# EAGLE design can4vscp_usb_rev_c (EAGLE 6.6.0)
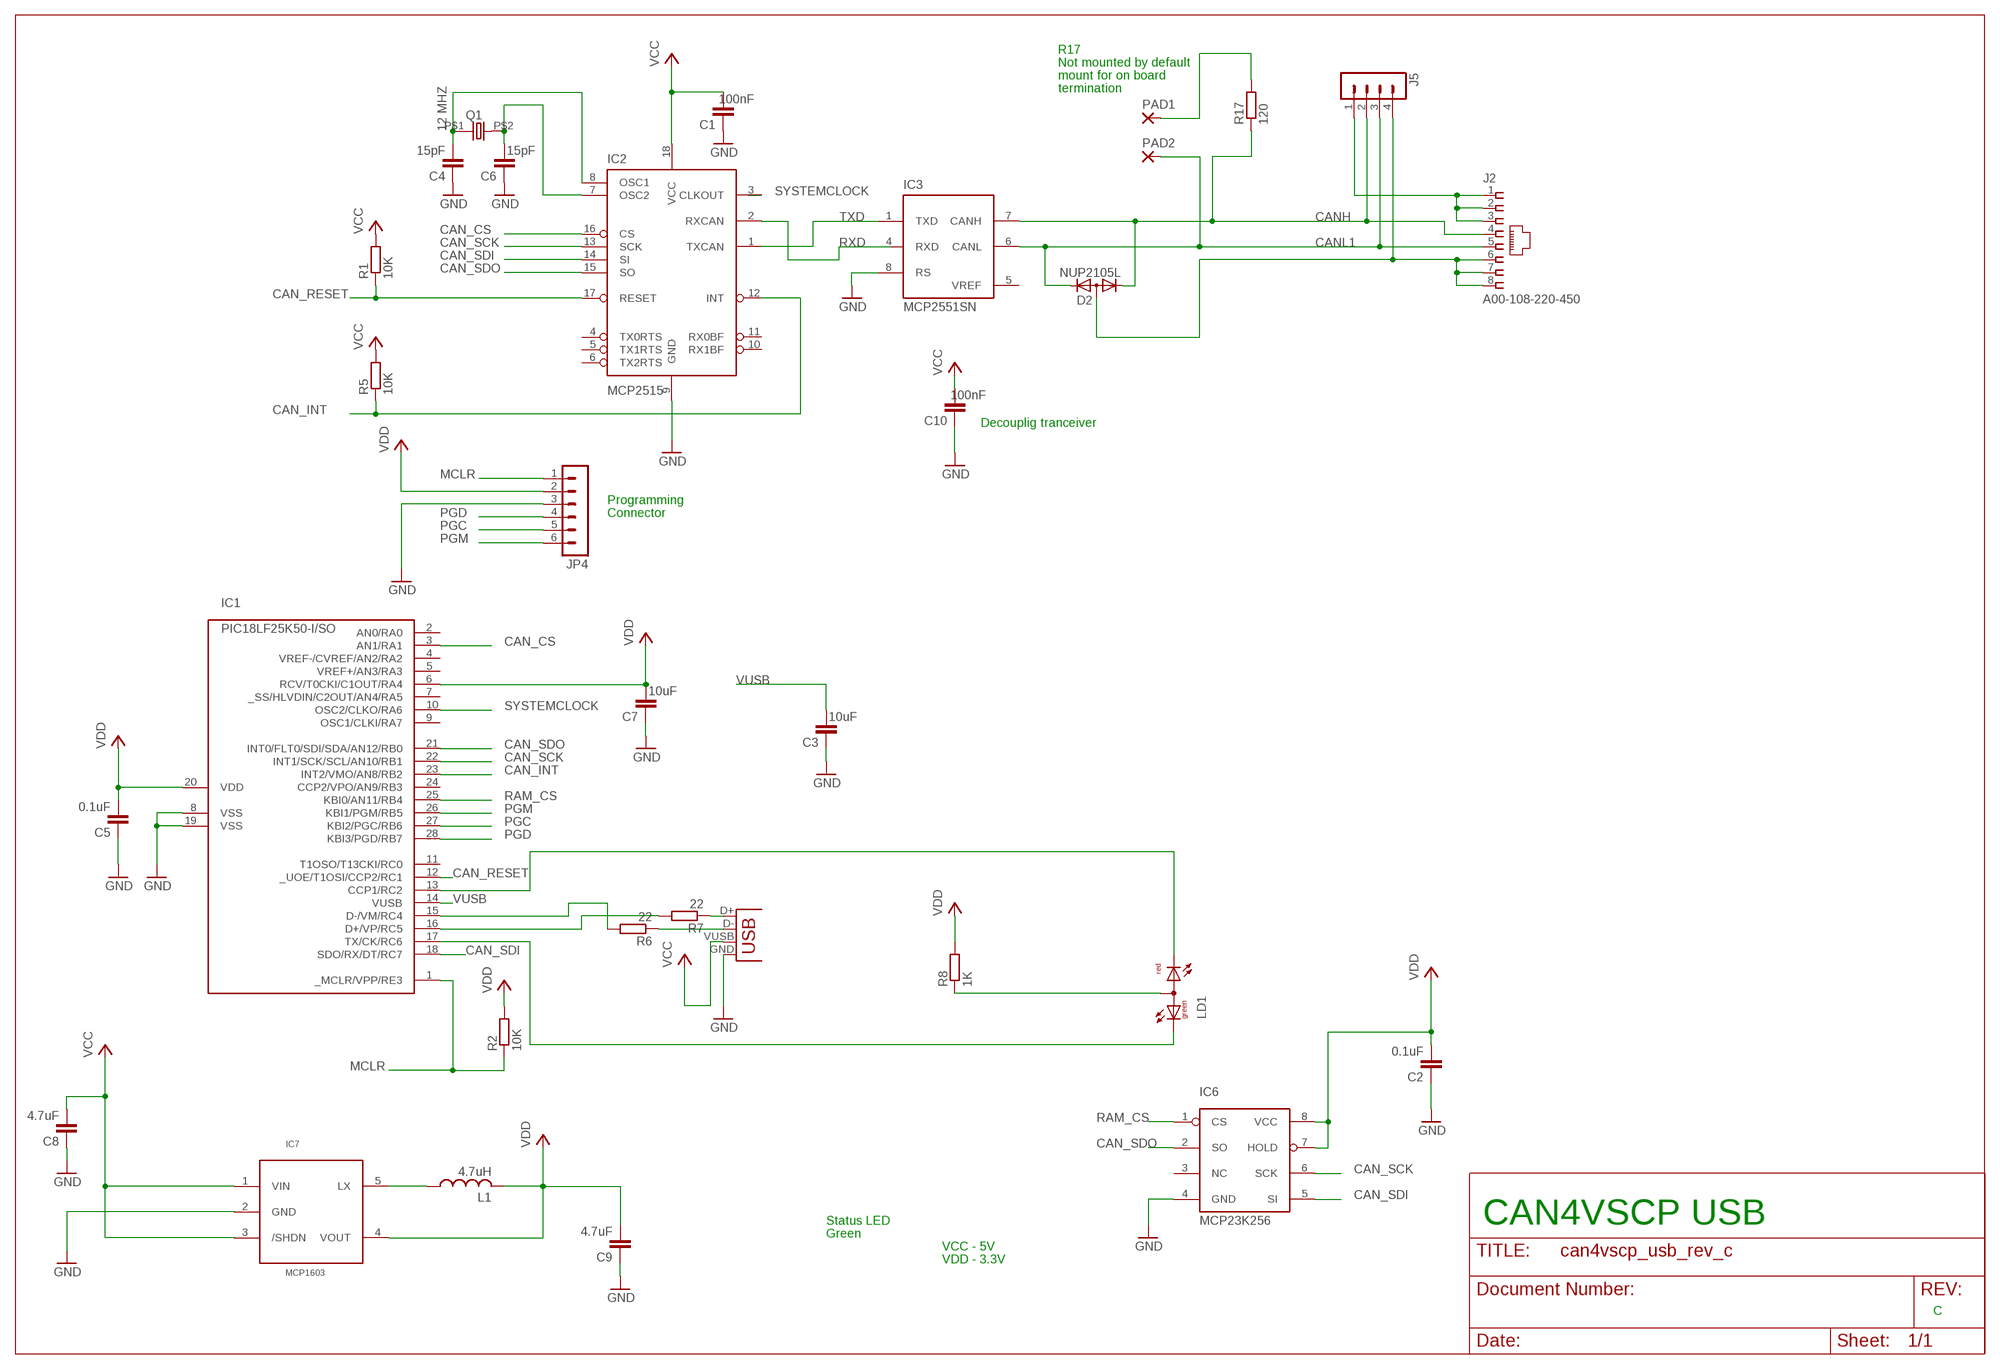
[diagram p0: schematic, sheet 1]

## Parts
C1  100nF  C-EUC0805  [C0805]
C2  0.1uF  C-EUC0805  [C0805]
C3  10uF  C-EUC0805  [C0805]
C4  15pF  C-EUC0805  [C0805]
C5  0.1uF  C-EUC0805  [C0805]
C6  15pF  C-EUC0805  [C0805]
C7  10uF  C-EUC0805  [C0805]
C8  4.7uF  C-EUC0805  [C0805]
C9  4.7uF  C-EUC0805  [C0805]
C10  100nF  C-EUC0805  [C0805]
D2  NUP2105L  DIODE-2CA|ACSOT23  [SOT23]
IC1  PIC18LF25K50-I/SO  PIC18LF2550-I/SO  [SO-28W]
IC2  MCP2515  [SO-18W]
IC3  MCP2551SN  [SO-08]
IC6  MCP23K256  MCP23A256  [SO-8]
IC7  MCP1603  [SOT23-5L]
J2  A00-108-220-450  [RJ-45]
J4  USB-B-S  [USB-B-SMT]
J5  MA04-1  [MA04-1]
JP4  MA06-1  [MA06-1]
L1  4.7uH  L-USL2012C  [L2012C]
LD1  DUOLED-RG-A  [DUOLED-A-5MM]
PAD1  1,6/0,8  [1,6/0,8]
PAD2  1,6/0,8  [1,6/0,8]
Q1  12 MHZ  HC-49S  [9C]
R1  10K  R-EU_R0805  [R0805]
R2  10K  R-EU_R0805  [R0805]
R5  10K  R-EU_R0805  [R0805]
R6  22  R-EU_R0805  [R0805]
R7  22  R-EU_R0805  [R0805]
R8  1K  R-EU_R0805  [R0805]
R17  120  R-EU_R0805  [R0805]

## Nets
CAN_CS: IC1.3(AN1/RA1) IC2.16(CS)
CAN_INT: IC1.23(INT2/VMO/AN8/RB2) IC2.12(INT) R5.1
CAN_RESET: IC1.12(_UOE/T1OSI/CCP2/RC1) IC2.17(RESET) R1.1
CAN_SCK: IC1.22(INT1/SCK/SCL/AN10/RB1) IC2.13(SCK) IC6.6(SCK)
CAN_SDI: IC1.18(SDO/RX/DT/RC7) IC2.14(SI) IC6.5(SI)
CAN_SDO: IC1.21(INT0/FLT0/SDI/SDA/AN12/RB0) IC2.15(SO) IC6.2(SO)
CANH: D2.1(K1) IC3.7(CANH) J2.4 J5.2 R17.1
CANL1: D2.2(K2) IC3.6(CANL) J2.5 J5.3 PAD2.1(P)
GND: C1.1 C2.1 C3.1 C4.1 C5.1 C6.1 C7.1 C8.1 C9.1 C10.1 D2.3(A) IC1.8(VSS) IC1.19(VSS) IC2.9(GND) IC3.8(RS) IC6.4(GND) IC7.2(GND) J2.6 J2.7 J2.8 J4.GND J5.4 JP4.3
MCLR: IC1.1(_MCLR/VPP/RE3) JP4.1 R2.1
N$1: IC1.16(D+/VP/RC5) R7.2
N$2: C4.2 IC2.8(OSC1) Q1.P$1
N$3: IC1.15(D-/VM/RC4) R6.2
N$6: IC1.13(CCP1/RC2) LD1.CR
N$7: C6.2 IC2.7(OSC2) Q1.P$2
N$8: LD1.A R8.1
N$9: IC1.17(TX/CK/RC6) LD1.CX(CG)
N$11: PAD1.1(P) R17.2
N$12: J2.1 J2.2 J2.3 J5.1
N$13: J4.D- R6.1
N$14: J4.D+ R7.1
N$16: IC7.5(LX) L1.1
PGC: IC1.27(KBI2/PGC/RB6) JP4.5
PGD: IC1.28(KBI3/PGD/RB7) JP4.4
PGM: IC1.26(KBI1/PGM/RB5) JP4.6
RAM_CS: IC1.25(KBI0/AN11/RB4) IC6.1(CS)
RXD: IC2.2(RXCAN)
SYSTEMCLOCK: IC1.10(OSC2/CLKO/RA6) IC2.3(CLKOUT)
TXD: IC2.1(TXCAN) IC3.1(TXD)
VCC: C1.2 C8.2 C10.2 IC2.18(VCC) IC7.1(VIN) IC7.3(/SHDN) J4.VUSB(VBUS) R1.2 R5.2
VDD: C2.2 C5.2 C7.2 C9.2 IC1.6(RCV/T0CKI/C1OUT/RA4) IC1.20(VDD) IC6.7(HOLD) IC6.8(VCC) IC7.4(VOUT) JP4.2 L1.2 R2.2 R8.2
VUSB: C3.2 IC1.14(VUSB)
Unconnected: IC1.2(AN0/RA0) IC1.4(VREF-/CVREF/AN2/RA2) IC1.5(VREF+/AN3/RA3) IC1.7(_SS/HLVDIN/C2OUT/AN4/RA5) IC1.9(OSC1/CLKI/RA7) IC1.11(T1OSO/T13CKI/RC0) IC1.24(CCP2/VPO/AN9/RB3) IC2.4(TX0RTS) IC2.5(TX1RTS) IC2.6(TX2RTS) IC2.10(RX1BF) IC2.11(RX0BF) IC3.4(RXD) IC6.3(NC)

## Notes on the sheet
- R17
- Not mounted by default
- mount for on board
- termination
- Decouplig tranceiver
- Programming
- Connector
- Status LED | CAN4VSCP USB
- Green
- VCC - 5V
- VDD - 3.3V
- C

## Power pins joined to a net without a drawn wire
GND: IC3.2(VSS)
VCC: IC3.3(VDD)
VREF: IC3.5(VREF)

## Library data of the parts
C1-C10 = rcl:C-EU: CAPACITOR, European symbol
D2 = diode:DIODE-2CA|AC: Dual DIODE Cathode-Anode|Anode-Cathode
IC1 = microchip-pic18fxx5x:PIC18*2550: PIC18*2550 Microchip FLASH Microcontroller with FS-USB DEVICE FEATURES Feature PIC18*2550 Program Memory (bytes) 32k Program Memory (instructions) 16384 I/O Ports Ports A, B, C, (E) Capture/Compare/PWM Modules 2 Enhanced Capture/Compare/PWM Modules 0 Parallel Communications (PSP) No 10-bit Analog-to-Digital Module 10 input Channels Package Types 28-pin PDIP 28-pin SOIC NOTES: F only after 18, means standard voltage range from 4.2v to 5.5v LF after 18, means extended voltage range from 2.0v to 5.5v T after entire device number, means supplied in tape and reel TQFP packages only -E before / denotes extended temperature range from -40°C to +120°C -I before / denotes industrial temperature range from -40°C to +85°C /PT suffix denotes TQFP package /SO suffix denotes SOIC package /SP suffix denotes Skinny Plastic DIP package /P suffix denotes Plastic DIP package /ML suffix denotes QFN package
IC2 = vscpcan:MCP2515
IC3 = microchip_can:MCP2551: High Speed CAN tranceiver
IC6 = vscpcan:MCP23A256
IC7 = eurosource_mcp1603:MCP1603
J2 = vscpcan:A00-108-220-450
J4 = con-usb:USB: USB Connectors
J5 = con-lstb:MA04-1: PIN HEADER; OC_FARNELL: unknown; OC_NEWARK: unknown
JP4 = con-lstb:MA06-1: PIN HEADER; OC_FARNELL: unknown; OC_NEWARK: unknown
L1 = rcl:L-US: INDUCTOR, American symbol
LD1 = led:DUOLED-RG-A: DUO LED 2 colors (red/green), 5 mm, round, common Anode www.ligitek.com or other producers.
PAD1 PAD2 = wirepad:1,6/0,8: THROUGH-HOLE PAD
Q1 = vscpcan:HC-49S: Digikey 887-1050-1-nd
R1 R2 R5-R8 R17 = rcl:R-EU_: RESISTOR, European symbol

## Board
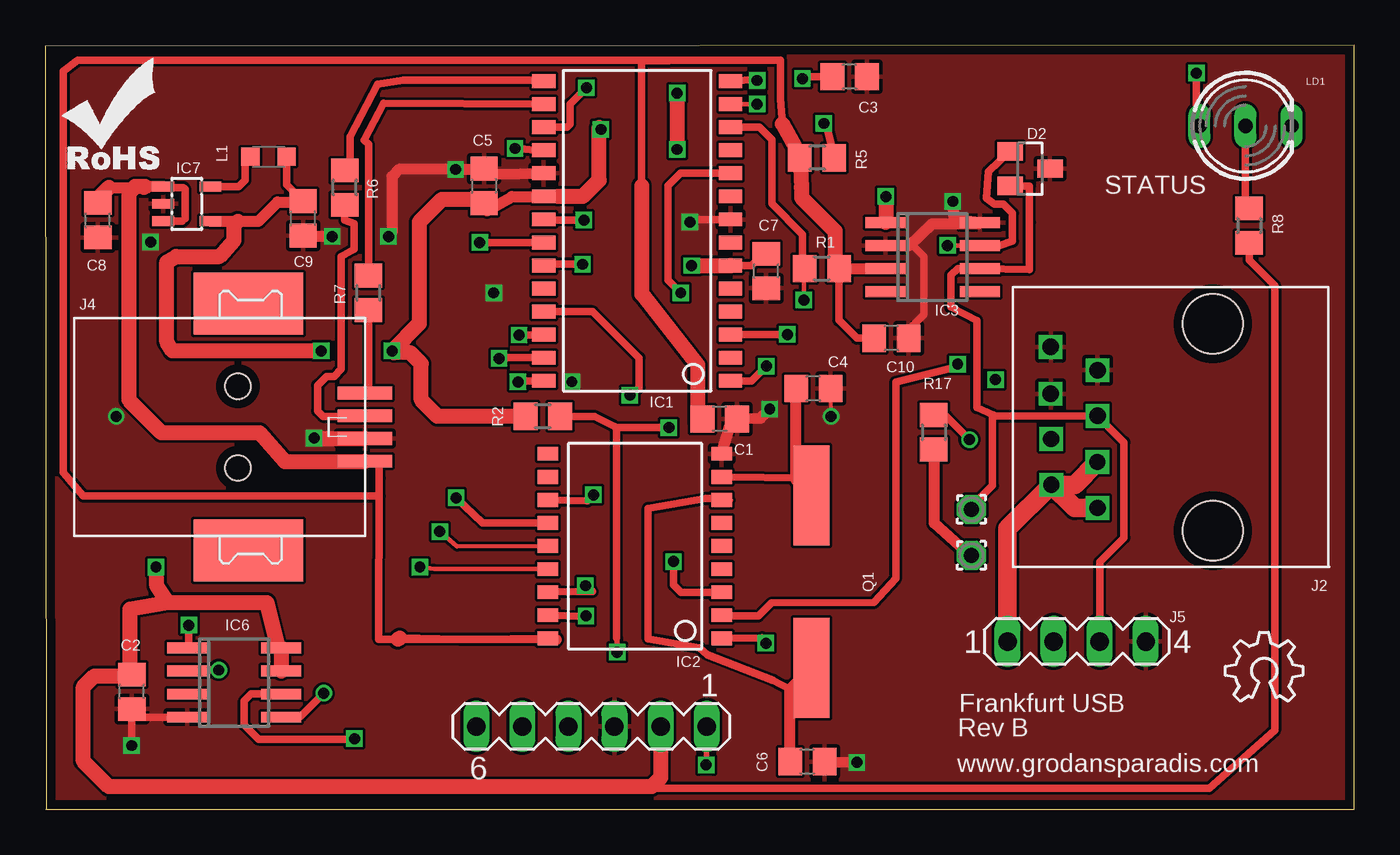
[diagram p1: board, top side]
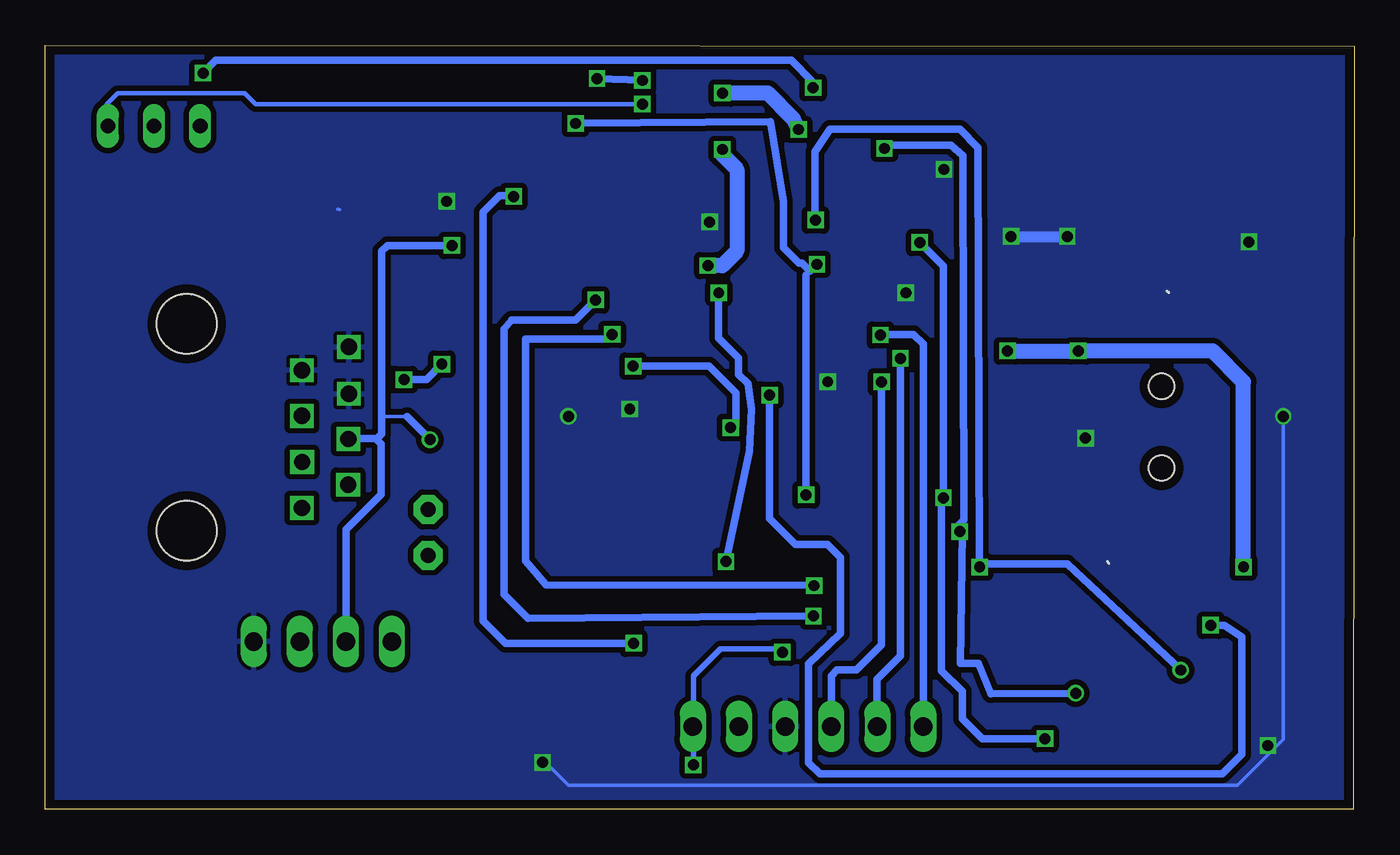
[diagram p2: board, bottom side, seen from below]

Size 72.07 x 42.08 mm. Coordinates in mm from the lower left corner, seen from the top.
Outline: 0.01,0 72.07,0 72.07,42.08 0,42.03 0.05,0.01
Copper layers (1*16): Top 0.035mm / dielectric 1.5mm / Bottom 0.035mm
Design rules "PCB-POOL": minimum track width 6mil, minimum drill 12mil, track to track 6mil, track to pad 6mil, pad to pad 6mil, via to via 6mil, smd to smd 6mil, copper to edge 20mil, drill to drill 8mil, minimum pad ring 8mil, minimum via ring 6mil, stop-mask expansion 3mil, vias tented up to drill 0mil, thermal gap 8mil

### Footprints (pad centres in the part's own frame; a part is rotated, then mirrored left to right if it is on the bottom)
C0805 = smd 1.3 x 1.5: 1 -0.95,0; 2 0.95,0
SOT23 = smd 1 x 1.4: 1 -0.95,-1.1; 2 0.95,-1.1; 3 0,1.1
SO-28W = smd 0.762 x 1.27: 1 -7.62,-5.207; 2 -6.35,-5.207; 3 -5.08,-5.207; 4 -3.81,-5.207; 5 -2.54,-5.207; 6 -1.27,-5.207; 7 0,-5.207; 8 1.27,-5.207; 9 2.54,-5.207; 10 3.81,-5.207; 11 5.08,-5.207; 12 6.35,-5.207; 13 7.62,-5.207; 14 8.89,-5.207; 15 8.89,5.08; 16 7.62,5.08; 17 6.35,5.08; 18 5.08,5.08; 19 3.81,5.08; 20 2.54,5.08; 21 1.27,5.08; 22 0,5.08; 23 -1.27,5.08; 24 -2.54,5.08; 25 -3.81,5.08; 26 -5.08,5.08; 27 -6.35,5.08; 28 -7.62,5.08
SO-18W = smd 0.762 x 1.143: 1 -5.08,-4.788; 2 -3.81,-4.788; 3 -2.54,-4.788; 4 -1.27,-4.788; 5 0,-4.788; 6 1.27,-4.788; 7 2.54,-4.788; 8 3.81,-4.788; 9 5.08,-4.788; 10 5.08,4.788; 11 3.81,4.788; 12 2.54,4.788; 13 1.27,4.788; 14 0,4.788; 15 -1.27,4.788; 16 -2.54,4.788; 17 -3.81,4.788; 18 -5.08,4.788
SO-08 = smd 0.6 x 2.2: 1 -1.905,-2.6; 2 -0.635,-2.6; 3 0.635,-2.6; 4 1.905,-2.6; 5 1.905,2.6; 6 0.635,2.6; 7 -0.635,2.6; 8 -1.905,2.6
SO-8 = smd 0.6 x 2.2: 1 -1.905,-2.6; 2 -0.635,-2.6; 3 0.635,-2.6; 4 1.905,-2.6; 5 1.905,2.6; 6 0.635,2.6; 7 -0.635,2.6; 8 -1.905,2.6
SOT23-5L = smd 0.55 x 1.2: 1 -0.95,-1.3; 2 0,-1.3; 3 0.95,-1.3; 4 0.95,1.3; 5 -0.95,1.3
RJ-45 = drill 0.9 square: 1 -4.45,6.35; 2 -3.17,8.89; 3 -1.92,6.36; 4 -0.65,8.91; 5 0.62,6.35; 6 1.84,8.93; 7 3.14,6.35; 8 4.42,8.93 | hole 3.3: -5.7,0; 5.7,0
USB-B-SMT = smd 6.04 x 3.4: 5 0.58,6.8; 6 0.58,-6.8 | smd 3 x 0.7: D+ 7,1.875; D- 7,0.625; GND 7,-0.625; VUSB 7,-1.875 | hole 1.4: 0,2.25; 0,-2.25
MA04-1 = drill 1.016 long: 1 -3.81,0; 2 -1.27,0; 3 1.27,0; 4 3.81,0
MA06-1 = drill 1.016 long: 1 -6.35,0; 2 -3.81,0; 3 -1.27,0; 4 1.27,0; 5 3.81,0; 6 6.35,0
L2012C = smd 1 x 1: 1 -1,0; 2 1,0
DUOLED-A-5MM = drill 0.813 long: A 0,0; CR 2.54,0; CX -2.54,0
1,6/0,8 = drill 0.813 pad 1.6 octagon: 1 0,0
9C = smd 5.5 x 2: P$1 -4.74,0; P$2 4.76,0
R0805 = smd 1.3 x 1.5: 1 -0.95,0; 2 0.95,0

### Placement (x,y rotation side)
C1  37.14,21.5 180 top
C2  4.76,6.48 90 top
C3  44.29,40.35 180 top
C4  42.29,23.17 180 top
C5  24.15,34.34 270 top
C6  41.96,2.63 180 top
C7  39.69,29.65 90 top
C8  2.89,32.45 90 top
C9  14.19,32.55 90 top
C10  46.59,25.95 180 top
D2  54.22,35.29 270 top
IC1  32.53,31.22 90 top
IC2  32.46,14.5 90 top
IC3  48.86,30.42 270 top
IC6  10.39,6.99 270 top
IC7  7.79,33.35 270 top
J2  64.29,21.05 90 top
J4  10.6,21.06 0 top
J5  56.79,9.25 0 top
JP4  30.07,4.57 180 top
L1  12.29,35.95 0 top
LD1  66.09,37.65 0 top
PAD1  50.99,13.99 0 top
PAD2  50.99,16.52 0 top
Q1  42.19,12.55 270 top
R1  42.76,29.79 0 top
R2  27.39,21.64 180 top
R5  42.5,35.89 180 top
R6  16.49,34.25 90 top
R7  17.79,28.45 90 top
R8  66.29,32.15 270 top
R17  48.92,20.77 270 top
U$1  [OSHW_6X150_NOTEXT]  64.99,5.95 0 top
U$2  [ROHS_SILK]  2.99,37.65 0 top
U$4  [VSCP_LOGO2]  17.59,7.05 0 top

### Tracks (layer width: path | path; a pad name or v marks a point on that pad's centre or on a via)
CAN_CS  (via drill 0.6)
  Top 0.254: 37.75,26.16 IC1.3
  Top 0.406: IC2.16 30.12,11.99 v29.74,12.32 | v40.86,26.16 37.75,26.16
  Bottom 0.254: 41.12,25.9 v40.86,26.16
  Bottom 0.406: v29.74,12.32 44.51,12.35 45.64,13.69 45.64,25.34 45.62,25.9 41.12,25.9
CAN_INT  (via drill 0.6)
  Top 0.254: 29.83,16.98 v30.18,17.32 | 27.51,30.02 IC1.23 | v42.87,37.78 42.95,37.91
  Top 0.406: IC2.12 29.83,16.98 | v29.58,30.02 27.51,30.02 | 42.95,37.91 R5.1
  Bottom 0.254: 30.18,29.42 29.96,29.64 v29.58,30.02 | 30.4,30.07 30.56,30.07
  Bottom 0.406: v30.18,17.32 30.18,29.42 | v42.87,37.78 32.14,37.88 31.43,33.47 31.43,30.95 30.56,30.07 | 29.96,29.64 30.4,30.07
CAN_RESET  (via drill 0.6)
  Top 0.254: 41.7,29.8 R1.1 41.77,29.73 v41.77,28.06 | 29.97,10.63 v29.77,10.65
  Top 0.406: IC1.12 39.32,37.57 40.01,36.89 40.01,33.36 41.7,31.66 41.7,29.8 | IC2.17 29.97,10.63
  Bottom 0.406: v29.77,10.65 45.49,10.52 46.8,11.83 46.8,26.45 46.41,26.95 42.88,26.95 v41.77,28.06
CAN_SCK  (via drill 0.6)
  Top 0.254: IC1.22 | 16.99,3.86 v17.02,3.89
  Top 0.406: IC2.13 24.07,15.78 v22.61,17.16 | v23.92,31.22 IC1.22 | IC6.6 11.33,6.35 10.95,5.97 10.95,4.65 11.73,3.86 16.99,3.86
  Bottom 0.254: 22.72,17.06 v22.61,17.16
  Bottom 0.406: v22.61,17.16 22.61,29.91 v23.92,31.22 | v17.02,3.89 20.48,3.89 21.58,4.99 21.58,6.5 22.72,7.64 22.72,17.06
CAN_SDI  (via drill 0.6)
  Top 0.203: IC6.5 14.06,5.13
  Top 0.254: IC2.14 22.68,14.48 v21.71,15.3 | 27.5,36.25 IC1.18
  Top 0.406: v25.86,36.4 27.5,36.25 | 14.06,5.13 v15.33,6.4
  Bottom 0.203: 21.58,15.29 v21.71,15.3
  Bottom 0.254: 25.57,36.59 v25.86,36.4
  Bottom 0.406: v21.71,15.3 21.81,15.62 21.49,15.94 21.54,36 22.2,36.59 25.57,36.59 | v15.33,6.4 19.99,6.35 20.69,8.05 21.68,8.05 21.58,15.29
CAN_SDO  (via drill 0.6)
  Top 0.203: IC6.2 7.71,7.67
  Top 0.254: IC2.15 21.4,13.24 v20.62,13.35 | 27.48,32.46 IC1.21
  Top 0.406: v29.66,32.46 27.48,32.46 | 7.71,7.67 v9.55,7.67
  Bottom 0.203: 20.31,13.52 v20.62,13.35
  Bottom 0.254: 29.7,32.5 v29.66,32.46
  Bottom 0.406: v20.62,13.35 20.72,36.45 21.72,37.45 28.88,37.45 29.7,36.23 29.7,32.5 | v9.55,7.67 15.8,13.52 20.31,13.52
CANH  (via drill 0.6)
  Top 0.203: R17.1 49.62,21.64
  Top 0.254: 52.53,31.05 IC3.7 v49.68,31.05
  Top 0.406: 52.53,31.05 53.26,31.29 53.26,32.84 52.75,33.35 52.25,33.35 51.82,33.68 51.92,35.14 D2.1 | 49.62,21.64 v50.89,20.37
  Bottom 0.203: 52.16,21.64 53.55,21.64
  Bottom 0.254: 53.8,20.44 53.89,20.44 | 55.35,20.44 J2.4
  Bottom 0.406: v49.68,31.05 53.23,31.05 53.55,30.74 53.55,21.64 53.55,20.69 53.8,20.44 | 55.35,20.44 53.89,20.44 53.59,20.14 53.59,17.35 55.52,15.42 J5.2 | v50.89,20.37 52.16,21.64
CANL1
  Top 0.203: PAD2.1 50.89,16.56 | 52.16,21.64 52.2,21.72
  Top 0.254: 52.2,21.72 52.35,21.66 | 50.25,29.77 IC3.6 | 57.94,21.66 J2.5
  Top 0.406: 52.2,21.72 51.29,22.13 51.29,26.93 49.86,27.66 49.86,29.43 50.25,29.77 | IC3.6 54.19,29.74 54.19,32.32 54.19,34.34 D2.2 | 52.35,21.66 57.94,21.66 | 50.89,16.56 52.16,17.83 52.16,21.64 | J5.3 58.06,13.62 59.39,14.95 59.39,20.22 J2.5
GND  (via drill 0.6)
  Top 0.203: v43.27,21.64 43.27,22.91 C4.1
  Top 0.254: 4.76,5.08 C2.1 | IC3.2 47.61,31.05 47.7,31.14 48.66,32.1 49.79,32.1 50.11,32.41 50.11,33.55 50.06,33.59
  Top 0.305: v14.79,20.45 14.81,20.43
  Top 0.406: IC1.8 35.63,32.49 v35.49,32.35 | IC6.4 4.76,5.08 4.76,3.98 v4.75,3.51 | C10.1 47.54,26.4 48.39,27.25 48.39,30.45 47.7,31.14
  Top 0.61: IC1.19 24.79,34.99 C5.1 24.24,35.25 v22.59,35.25 19.49,35.25 19.09,34.85 19.09,31.75 v18.89,31.55 | C6.1 v44.68,2.58 v44.69,2.59 | v39.89,22.05 39.39,21.55 C1.1 37.7,21.12 IC2.9 | v49.97,33.49 50.05,32.48 IC3.8 51.39,32.26 48.84,32.26 47.59,31.05 IC3.2 | v15.79,31.55 14.24,31.55 C9.1
  Top 0.813: 14.81,20.43 J4.GND
  Bottom 0.203: v3.9,21.64 3.9,3.86 6.44,1.32 43.27,1.32 44.54,2.59 v44.69,2.59 | 55.85,33.04 55.97,33.07
  Bottom 0.61: v18.89,31.55 v15.79,31.55
  other vias: 5.79,31.25 24.69,28.45 28.99,23.55
  pour Bottom (isolate 0.305): -0.62,33.99 -0.32,1.45 -0.43,-0.24 44.56,0.46 72.53,-0.27 72.36,42.93 52.05,42.31 -0.55,42.79 -0.57,34.77
  pour Top: -0.62,42.77 -0.42,0.22 0.62,-0.33 46.02,0.47 72.46,-0.28 72.36,42.87 46.97,42.17
MCLR  (via drill 0.6)
  Top 0.254: 31.45,21.02 31.34,21.08 31.39,21.03 | R2.1
  Top 0.305: JP4.1 36.42,2.68 v36.39,2.45 | v31.49,8.65 31.49,9.4 31.45,9.43
  Top 0.406: 31.45,9.43 31.45,21.02 | 31.34,21.08 30.24,21.65 R2.1 | IC1.1 38.9,23.6 v39.7,24.41 | 31.39,21.03 v34.33,21.03
  Bottom 0.254: v34.33,21.03 34.04,21.14
  Bottom 0.305: v36.39,2.45 36.39,7.35 34.89,8.85 31.69,8.85 v31.49,8.65
  Bottom 0.406: v39.7,24.41 35.51,24.41 34.04,22.94 34.04,21.14
N$1
  Top 0.254: IC1.16
  Top 0.406: IC1.16 18.63,38.89 17.56,36.86 17.79,36.63 R7.2
N$2
  Top 0.254: 41.95,18.25 42.44,17.75 42.19,17.5 Q1.P$1
  Top 0.406: IC2.8 41.95,18.25
  Top 0.61: C4.2 41.34,18.14 Q1.P$1
N$3
  Top 0.254: IC1.15 27.48,40.15
  Top 0.406: IC1.15 27.41,40.15 19.69,40.15 18.29,39.95 16.79,37.05 16.79,35.5 R6.2
N$6  (via drill 0.6)
  Top 0.254: IC1.13 v39.18,38.84 v39.19,38.85
  Bottom 0.254: v39.19,38.85 60.49,38.85 61.09,39.45 68.09,39.45 68.69,38.85 68.69,37.71 LD1.CR
N$7
  Top 0.254: 37.75,17.03 IC2.7 37.15,17.14
  Top 0.406: 41.01,6.61 40.07,7.11 36.47,8.52 36.03,8.89 33.2,9.4 33.2,16.58 36.35,17.14 37.15,17.14
  Top 0.61: C6.2 41.01,6.61 Q1.P$2
N$8
  Top 0.254: 66.09,33.3 R8.1
  Top 0.406: LD1.A 66.09,33.3
N$9  (via drill 0.6)
  Top 0.406: IC1.17 28.71,37.57 28.89,37.75 28.89,38.85 v29.79,39.75 | v63.39,40.55 63.39,37.81 LD1.CX
  Bottom 0.406: v29.79,39.75 29.79,40.05 30.99,41.25 62.69,41.25 v63.39,40.55
N$11
  Top 0.203: 48.95,19.57 R17.2 | PAD1.1 50.89,14.02
  Top 0.61: 48.95,19.57 48.95,15.76 50.89,14.02
N$12
  Top 1.016: J5.1 52.98,15.46 J2.2 | J2.2 56.68,17.88 J2.3 | J2.1 56.68,16.6 J2.2
N$13
  Top 0.406: R6.1 16.49,32.45 16.99,32.25 16.99,30.85 16.29,30.45 16.29,24.25 15.89,23.85 15.49,23.85 14.99,23.35 14.99,21.95 15.29,21.65 17.57,21.65 J4.D-
N$14
  Top 0.406: R7.1 17.79,23.12 J4.D+
N$16
  Top 0.406: IC7.5 10.64,34.3 10.99,34.65 10.99,35.65 L1.1
PGC  (via drill 0.6)
  Top 0.254: v24.98,24.83 25.02,24.87
  Top 0.406: 25.02,24.87 IC1.27
  Bottom 0.254: JP4.5 26.27,4.58
  Bottom 0.406: v24.98,24.83 24.98,8.46 26.27,7.17 26.27,4.58
PGD  (via drill 0.6)
  Top 0.254: v26.02,23.54 26.08,23.6
  Top 0.406: 26.08,23.6 IC1.28
  Bottom 0.254: JP4.4
  Bottom 0.406: v26.02,23.54 26.02,9.06 27.41,7.67 28.48,7.67 28.79,7.36 JP4.4
PGM  (via drill 0.6)
  Top 0.254: 27.43,26.12 IC1.26
  Top 0.406: v26.08,26.12 27.43,26.12
  Bottom 0.254: 26.05,26.16 v26.08,26.12
  Bottom 0.406: JP4.6 23.72,25.62 24.26,26.16 26.05,26.16
RAM_CS  (via drill 0.6)
  Top 0.254: 7.89,8.99 IC6.1
  Top 0.406: IC1.25 30.14,27.41 32.69,24.86 32.69,23.21 v32.19,22.81 | v7.89,10.14 7.89,8.99
  Bottom 0.406: v32.19,22.81 32.19,16.01 30.77,14.6 29.01,14.6 28.29,13.87 28.29,9.68 30.06,8.01 30.06,2.56 29.42,1.97 7.27,1.97 6.2,3.04 6.2,9.5 7.14,10.14 v7.89,10.14
RXD  (via drill 0.6)
  Top 0.254: IC2.2 37.29,10.65
  Top 0.406: v50.24,24.52 50.24,24.4 46.84,23.52 46.84,12.73 45.62,11.39 39.99,11.37 39.27,10.65 37.29,10.65
  Bottom 0.406: v52.32,23.67 51.09,23.67 v50.24,24.52
SYSTEMCLOCK  (via drill 0.6)
  Top 0.406: IC1.10 34.97,35.03 34.29,34.35 34.29,29.15 v34.99,28.45 | v34.59,13.65 34.59,12.35 34.99,11.95 37.23,11.95 IC2.3
  Bottom 0.406: v34.99,28.45 34.99,25.95 33.89,24.85 33.89,23.95 33.39,23.45 33.19,22.05 33.29,19.75 v34.59,13.65
TXD  (via drill 0.6)
  Top 0.254: 46.28,32.34 IC3.1
  Top 0.406: IC2.1 39.47,9.46 v39.68,9.15
  Top 0.813: v46.28,33.75 46.28,32.34
  Bottom 0.254: 46.34,33.82 v46.28,33.75
  Bottom 0.406: v39.68,9.15 46.73,9.15 47.98,10.39 47.98,32.9 47.06,33.82 46.34,33.82
VCC
  Top 0.203: 33.11,34.34 32.83,34.34
  Top 0.406: 36,41.25 40.49,41.25 40.49,39.15 40.59,37.75 | 19.52,9.43 22.85,9.36 28.12,9.36 | IC2.18 23.49,9.36 18.36,9.37 18.39,18.25 | 18.39,18.25 18.39,19.18 17.9,19.18 J4.VUSB | 32.83,34.34 32.83,41.21 36,41.25 | 36,41.25 1.79,41.25 0.99,40.65 0.99,18.55 2.09,17.25 18.39,17.25 18.39,18.25 | C10.2 44.69,25.95 43.69,26.95 43.69,29.77 R1.2 | IC7.3 7.54,32.4 7.69,32.55 7.69,34.15 7.59,34.25 6.54,34.25 IC7.1
  Top 0.61: 41.59,35.94 R5.2 | 43.49,29.81 R1.2 IC3.3 | 28.12,9.36 IC2.18 | 32.84,28.38 32.94,28.28 | 35.92,21.3 C1.2 | 41.62,34.25 41.64,34.23 | IC7.1 5.49,34.3 | 3.49,34.25 5.44,34.25
  Top 0.813: 40.59,37.75 41.59,35.94 | R5.2 41.62,34.25 41.65,33.69 43.49,31.85 43.49,29.81 | 19.4,9.37 19.52,9.43 | 32.83,34.34 32.84,28.38 | 32.94,28.28 35.92,24.48 35.92,21.3 | J4.VUSB 17.57,19.15 13.19,19.15 11.79,20.75 6.39,20.75 4.59,22.55 4.59,33.95 4.94,34.3 5.49,34.3 5.44,34.25 | C8.2 2.89,33.65 3.49,34.25
VDD  (via drill 0.6)
  Top 0.203: C2.2 4.67,7.57 | 12.79,8.94 IC6.8 | C5.2 24.22,33.07
  Top 0.254: 28.2,33.76 IC1.20
  Top 0.406: C7.2 39.54,30.6 38.89,29.95 IC1.6 | L1.2 13.29,34.4 C9.2 | 24.22,33.07 24.31,32.97 | 27.43,33.75 IC1.20 | R8.2 66.29,30.25 67.69,28.85 67.69,4.35 64.09,1.15 33.59,1.15 33.09,1.25
  Top 0.61: IC7.4 10.59,32.4 11.74,32.4 12.79,33.45 14.14,33.45 C9.2 | 24.48,33.76 C5.2 23.73,33.59 | 24.31,32.97 25.69,33.75 27.43,33.75
  Top 0.813: IC6.8 IC6.7 | 4.67,7.57 4.67,11.04 6.74,11.4 | 6.74,11.4 12.19,11.4 12.79,8.94 | 23.73,33.59 21.83,33.59 20.59,32.35 20.59,26.75 v19.09,25.25 19.19,25.15 20.09,25.15 20.69,24.55 20.69,22.55 21.59,21.64 R2.2 | v15.19,25.25 6.99,25.25 6.69,25.75 6.69,30.15 7.19,30.45 9.59,30.45 10.39,31.35 10.39,32.2 10.59,32.4 | 6.74,11.4 6.14,12.3 v6.09,13.35 | 28.2,33.76 29.6,33.76 30.49,34.65 30.49,37.55 v30.59,37.45 | v34.79,39.45 v34.79,36.35 | v35.59,29.95 IC1.6 | JP4.2 33.88,1.74 33.39,1.25 33.09,1.25 3.49,1.25 2.09,2.65 2.09,6.75 2.69,7.35 4.68,7.35 C2.2
  Bottom 0.813: v19.09,25.25 v15.19,25.25 7.79,25.25 6.09,23.55 v6.09,13.35 | v30.59,37.45 30.89,38.05 32.29,39.45 v34.79,39.45 | v34.79,36.35 34.79,36.05 33.99,35.25 33.99,30.75 34.79,29.95 v35.59,29.95
VUSB  (via drill 0.6)
  Top 0.406: IC1.14 39.25,40.21 v39.19,40.15 | v41.69,40.25 42.19,40.35 C3.2
  Bottom 0.406: v39.19,40.15 v41.69,40.25

### Text on the board
tPlace: STATUS
tNames: Frankfurt USB | Rev B | www.grodansparadis.com